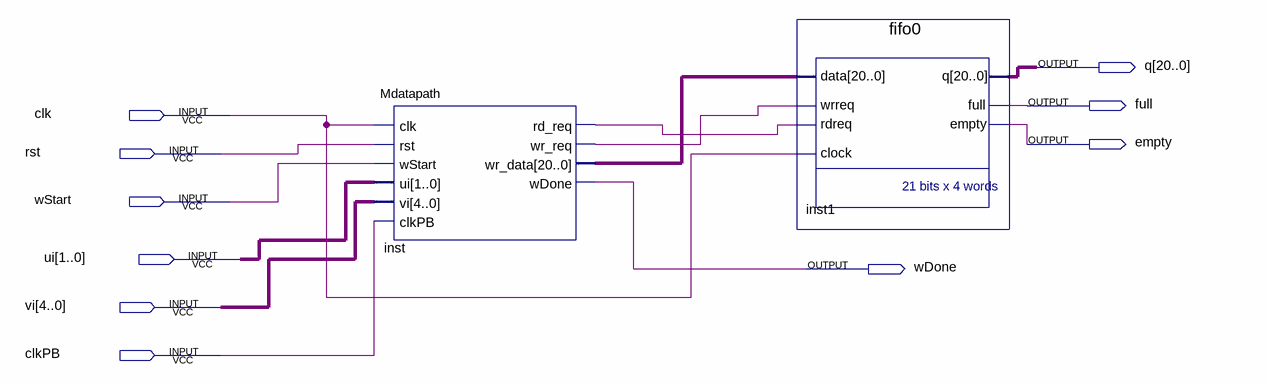
[diagram p0: schematic sheet]
// Quartus schematic top.bdf as structural Verilog: 2 symbols, 10 pins
module top (
  input  clk,
  input  rst,
  input  wStart,
  input  [1:0] ui,
  input  [4:0] vi,
  input  clkPB,
  output [20:0] q,
  output full,
  output empty,
  output wDone
);

  wire inst_rd_req, inst_wr_req;
  wire [20:0] inst_wr_data;

  Mdatapath inst (
    .clk(clk), .rst(rst), .wStart(wStart), .ui(ui), .vi(vi), .clkPB(clkPB), .rd_req(inst_rd_req),
    .wr_req(inst_wr_req), .wr_data(inst_wr_data), .wDone(wDone));
  fifo0 inst1 (
    .data(inst_wr_data), .wrreq(inst_wr_req), .rdreq(inst_rd_req), .clock(clk), .q(q), .full(full),
    .empty(empty));
endmodule
